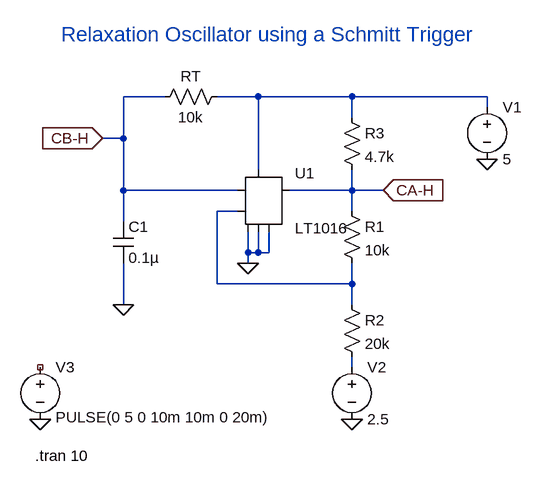
[diagram p0: schematic relaxation_osc_with_schmitt_trigger_ltspice.asc]
relaxation_osc_with_schmitt_trigger_ltspice.asc, the LTspice schematic file:
Version 4
SHEET 1 880 756
WIRE 32 16 -32 16
WIRE 176 16 112 16
WIRE 320 16 176 16
WIRE 528 16 320 16
WIRE 528 32 528 16
WIRE 320 48 320 16
WIRE -32 80 -32 16
WIRE -32 80 -64 80
WIRE 176 128 176 16
WIRE -32 160 -32 80
WIRE 144 160 -32 160
WIRE 320 160 320 128
WIRE 320 160 224 160
WIRE 368 160 320 160
WIRE 144 192 112 192
WIRE 320 192 320 160
WIRE -32 208 -32 160
WIRE 160 256 160 224
WIRE 176 256 176 224
WIRE 176 256 160 256
WIRE 192 256 192 224
WIRE 192 256 176 256
WIRE 160 272 160 256
WIRE 112 304 112 192
WIRE 320 304 320 272
WIRE 320 304 112 304
WIRE -32 336 -32 272
WIRE 320 336 320 304
WIRE 320 432 320 416
FLAG 368 160 CA-H
IOPIN 368 160 In
FLAG -64 80 CB-H
IOPIN -64 80 In
FLAG 160 272 0
FLAG 528 112 0
FLAG 320 512 0
FLAG -160 512 0
FLAG -32 336 0
SYMBOL Comparators\\LT1016 176 112 R0
SYMATTR InstName U1
SYMBOL res 304 32 R0
SYMATTR InstName R3
SYMATTR Value 4.7k
SYMBOL voltage 528 16 R0
SYMATTR InstName V1
SYMATTR Value 5
SYMBOL voltage 320 416 R0
SYMATTR InstName V2
SYMATTR Value 2.5
SYMBOL voltage -160 416 R0
WINDOW 123 0 0 Left 0
WINDOW 39 0 0 Left 0
WINDOW 3 24 93 Left 2
SYMATTR Value PULSE(0 5 0 10m 10m 0 20m)
SYMATTR InstName V3
SYMBOL res 304 176 R0
SYMATTR InstName R1
SYMATTR Value 10k
SYMBOL res 304 320 R0
SYMATTR InstName R2
SYMATTR Value 20k
SYMBOL res 128 0 R90
WINDOW 0 0 56 VBottom 2
WINDOW 3 32 56 VTop 2
SYMATTR InstName RT
SYMATTR Value 10k
SYMBOL cap -48 208 R0
SYMATTR InstName C1
SYMATTR Value 0.1µ
TEXT -128 -80 Left 3 ;Relaxation Oscillator using a Schmitt Trigger
TEXT -168 568 Left 2 !.tran 10

The netlist it stands for:
* relaxation_osc_with_schmitt_trigger_ltspice.asc
XU1 N001 N002 CB-H 0 0 0 CA-H NC_01 LT1016
R3 N001 CA-H 4.7k
V1 N001 0 5
V2 N003 0 2.5
V3 NC_02 0 PULSE(0 5 0 10m 10m 0 20m)
R1 CA-H N002 10k
R2 N002 N003 20k
RT N001 CB-H 10k
C1 CB-H 0 0.1µ
* Relaxation Oscillator using a Schmitt Trigger
.tran 10
.lib LTC.lib
.backanno
.end